# EAGLE design testTool1 (EAGLE 4.16)
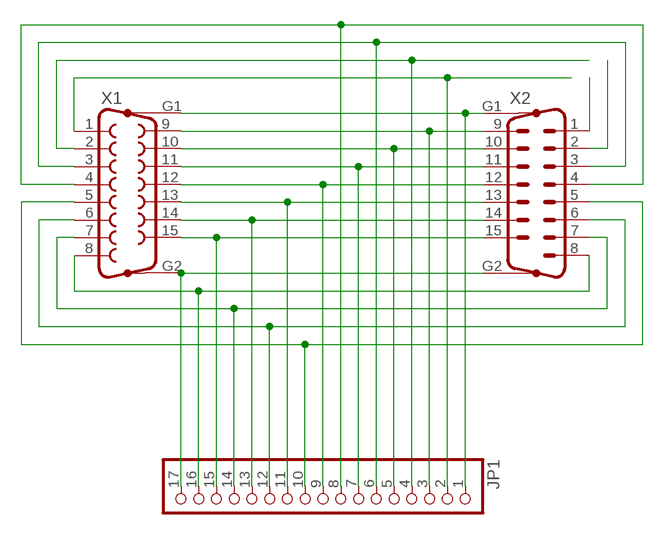
[diagram p0: schematic, sheet 1]

## Parts
JP1  PINHD-1X17  [1X17]
X1  F15HP  [F15HP]
X2  M15HP  [M15HP]

## Nets
N$1: JP1.15 X1.15 X2.15
N$2: JP1.13 X1.14 X2.14
N$3: JP1.11 X1.13 X2.13
N$4: JP1.9 X1.12 X2.12
N$5: JP1.7 X1.11 X2.11
N$6: JP1.5 X1.10 X2.10
N$7: JP1.3 X1.9 X2.9
N$8: JP1.1 X1.G1 X2.G1
N$9: JP1.17 X1.G2 X2.G2
N$10: JP1.2 X1.1 X2.1
N$11: JP1.4 X1.2 X2.2
N$12: JP1.6 X1.3 X2.3
N$13: JP1.16 X1.8 X2.8
N$14: JP1.14 X1.7 X2.7
N$15: JP1.12 X1.6 X2.6
N$16: JP1.10 X1.5 X2.5
N$17: JP1.8 X1.4 X2.4

## Library data of the parts
JP1 = pinhead:PINHD-1X17: PIN HEADER
X1 = con-subd:F15HP: SUB-D
X2 = con-subd:M15HP: SUB-D

## Board
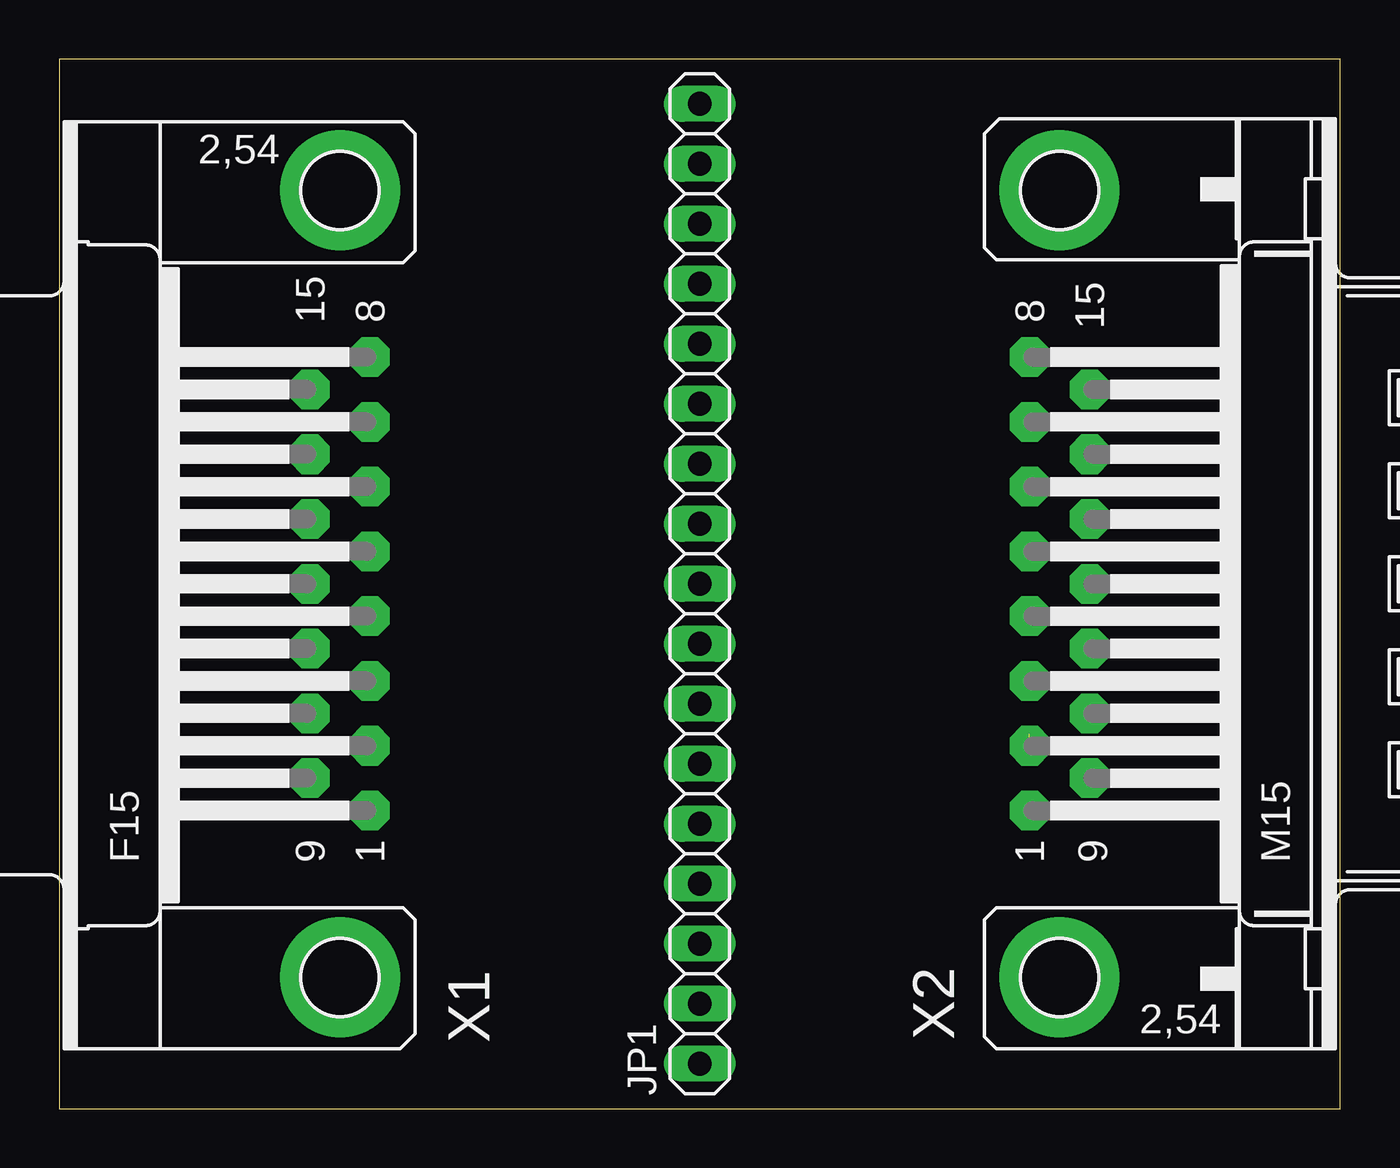
[diagram p1: board, top side]
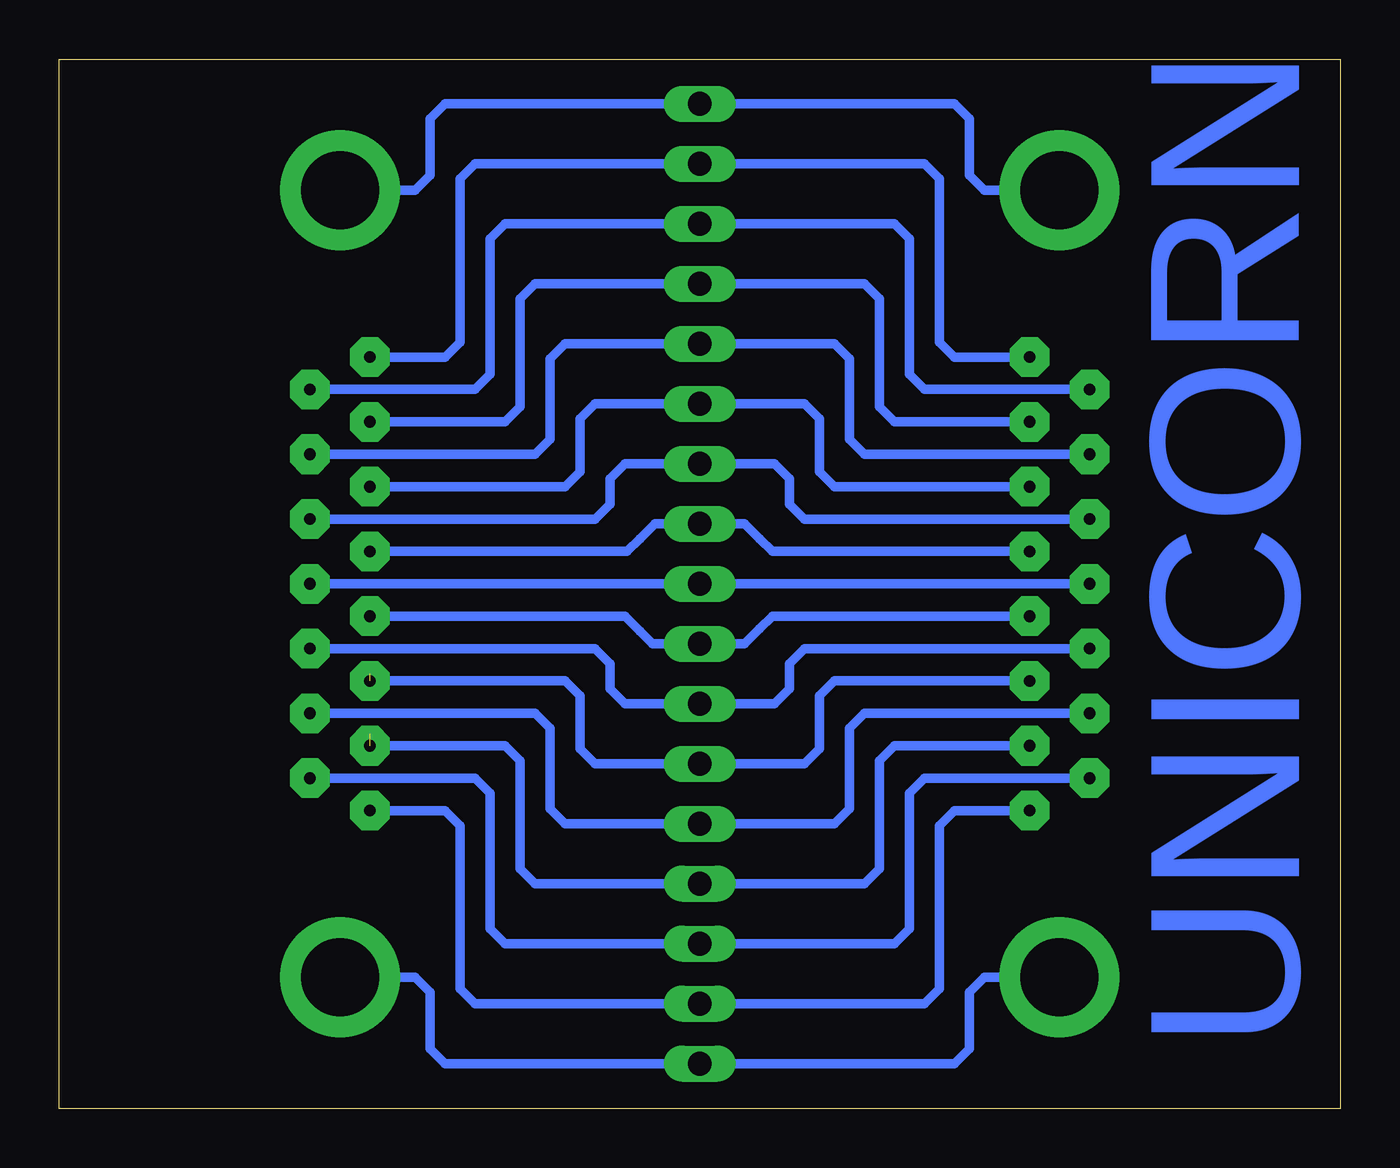
[diagram p2: board, bottom side, seen from below]

Size 54.28 x 44.44 mm. Coordinates in mm from the lower left corner, seen from the top.
Outline: 0,0 54.28,0 54.28,44.44 0,44.44 0,0
Copper layers (1*16): Top 0.035mm / dielectric 1.5mm / Bottom 0.035mm
Design rules "default": minimum track width 10mil, minimum drill 24mil, track to track 8mil, track to pad 8mil, pad to pad 8mil, via to via 8mil, smd to smd 8mil, copper to edge 40mil, drill to drill 8mil, minimum pad ring 10mil, minimum via ring 8mil, stop-mask expansion 4mil, vias tented up to drill 0mil, thermal gap 10mil

### Footprints (pad centres in the part's own frame; a part is rotated, then mirrored left to right if it is on the bottom)
1X17 = drill 1.016 long: 1 -20.32,0; 2 -17.78,0; 3 -15.24,0; 4 -12.7,0; 5 -10.16,0; 6 -7.62,0; 7 -5.08,0; 8 -2.54,0; 9 0,0; 10 2.54,0; 11 5.08,0; 12 7.62,0; 13 10.16,0; 14 12.7,0; 15 15.24,0; 16 17.78,0; 17 20.32,0
F15HP = drill 0.5 pad 1.676 octagon: 1 -9.601,-1.27; 2 -6.858,-1.27; 3 -4.115,-1.27; 4 -1.372,-1.27; 5 1.372,-1.27; 6 4.115,-1.27; 7 6.858,-1.27; 8 9.601,-1.27; 9 -8.23,1.27; 10 -5.486,1.27; 11 -2.743,1.27; 12 0,1.27; 13 2.743,1.27; 14 5.486,1.27; 15 8.23,1.27 | drill 3.302 pad 5.08 round: G1 -16.662,0; G2 16.662,0
M15HP = drill 0.5 pad 1.676 octagon: 1 -9.601,1.27; 2 -6.858,1.27; 3 -4.115,1.27; 4 -1.372,1.27; 5 1.372,1.27; 6 4.115,1.27; 7 6.858,1.27; 8 9.601,1.27; 9 -8.23,-1.27; 10 -5.486,-1.27; 11 -2.743,-1.27; 12 0,-1.27; 13 2.743,-1.27; 14 5.486,-1.27; 15 8.23,-1.27 | drill 3.302 pad 5.08 round: G1 -16.662,0; G2 16.662,0

### Placement (x,y rotation side)
JP1  27.14,22.22 90 top
X1  11.9,22.22 90 top
X2  42.38,22.22 90 top

### Tracks (layer width: path | path; a pad name or v marks a point on that pad's centre or on a via)
N$1
  Bottom 0.406: X1.15 17.61,30.45 18.25,31.08 18.25,36.83 18.88,37.46 JP1.15 29.68,37.46 35.39,37.46 36.03,36.83 36.03,31.08 36.66,30.45 X2.15
N$2
  Bottom 0.406: X1.14 20.15,27.71 20.79,28.34 20.79,31.74 21.42,32.38 JP1.13 29.68,32.38 32.85,32.38 33.49,31.74 33.49,28.34 34.12,27.71 X2.14
N$3
  Bottom 0.406: X1.13 22.7,24.96 23.33,25.6 23.33,26.66 23.96,27.3 JP1.11 29.68,27.3 30.31,27.3 30.95,26.66 30.95,25.6 31.58,24.96 X2.13 43.65,24.76
N$4
  Bottom 0.406: X1.12 JP1.9 28.41,22.22 X2.12
N$5
  Bottom 0.406: X1.11 22.7,19.48 23.33,18.84 23.33,17.77 23.96,17.14 JP1.7 29.68,17.14 30.31,17.14 30.95,17.77 30.95,18.84 31.58,19.48 X2.11 43.65,19.68
N$6
  Bottom 0.406: X1.10 20.15,16.73 20.79,16.1 20.79,12.7 21.42,12.06 JP1.5 29.68,12.06 32.85,12.06 33.49,12.7 33.49,16.1 34.12,16.73 X2.10
N$7
  Bottom 0.406: X1.9 17.61,13.99 18.25,13.36 18.25,7.62 18.88,6.98 JP1.3 29.68,6.98 35.39,6.98 36.03,7.62 36.03,13.36 36.66,13.99 X2.9
N$8
  Bottom 0.406: X1.G1 15.08,5.56 15.71,4.92 15.71,2.54 16.34,1.9 JP1.1 29.68,1.9 37.94,1.9 38.57,2.54 38.57,4.92 39.2,5.56 X2.G1
N$9
  Bottom 0.406: X1.G2 15.08,38.88 15.71,39.52 15.71,41.91 16.34,42.54 JP1.17 37.94,42.54 38.57,41.91 38.57,39.52 39.2,38.88 X2.G2
N$10
  Bottom 0.406: X1.1 16.34,12.62 16.98,11.98 16.98,5.08 17.61,4.44 JP1.2 28.41,4.44 36.66,4.44 37.3,5.08 37.3,11.98 37.94,12.62 X2.1
N$11  (1 unrouted)
  Bottom 0.406: X1.2 18.88,15.36 19.52,14.73 19.52,10.16 20.15,9.52 JP1.4 34.12,9.52 34.76,10.16 34.76,14.73 35.39,15.36 X2.2
N$12  (1 unrouted)
  Bottom 0.406: X1.3 21.42,18.11 22.06,17.47 22.06,15.24 22.7,14.6 JP1.6 31.58,14.6 32.22,15.24 32.22,17.47 32.85,18.11 X2.3
N$13
  Bottom 0.406: X1.8 16.34,31.82 16.98,32.46 16.98,39.37 17.61,40 JP1.16 29.68,40 36.66,40 37.3,39.37 37.3,32.46 37.94,31.82 X2.8
N$14
  Bottom 0.406: X1.7 18.88,29.08 19.52,29.71 19.52,34.29 20.15,34.92 JP1.14 29.68,34.92 34.12,34.92 34.76,34.29 34.76,29.71 35.39,29.08 X2.7
N$15
  Bottom 0.406: X1.6 21.42,26.33 22.06,26.97 22.06,29.2 22.7,29.84 JP1.12 29.68,29.84 31.58,29.84 32.22,29.2 32.22,26.97 32.85,26.33 X2.6
N$16
  Bottom 0.406: X1.5 24.07,23.59 24.6,24.12 25.23,24.76 JP1.10 28.41,24.76 29.04,24.76 29.68,24.12 30.21,23.59 X2.5 41.11,23.49
N$17
  Bottom 0.406: X1.4 24.07,20.85 24.6,20.31 25.23,19.68 JP1.8 29.15,19.68 29.68,20.21 30.31,20.85 X2.4 41.11,20.95

### Text on the board
Bottom: UNICORN